# EAGLE design untitled (EAGLE 9.6.2)
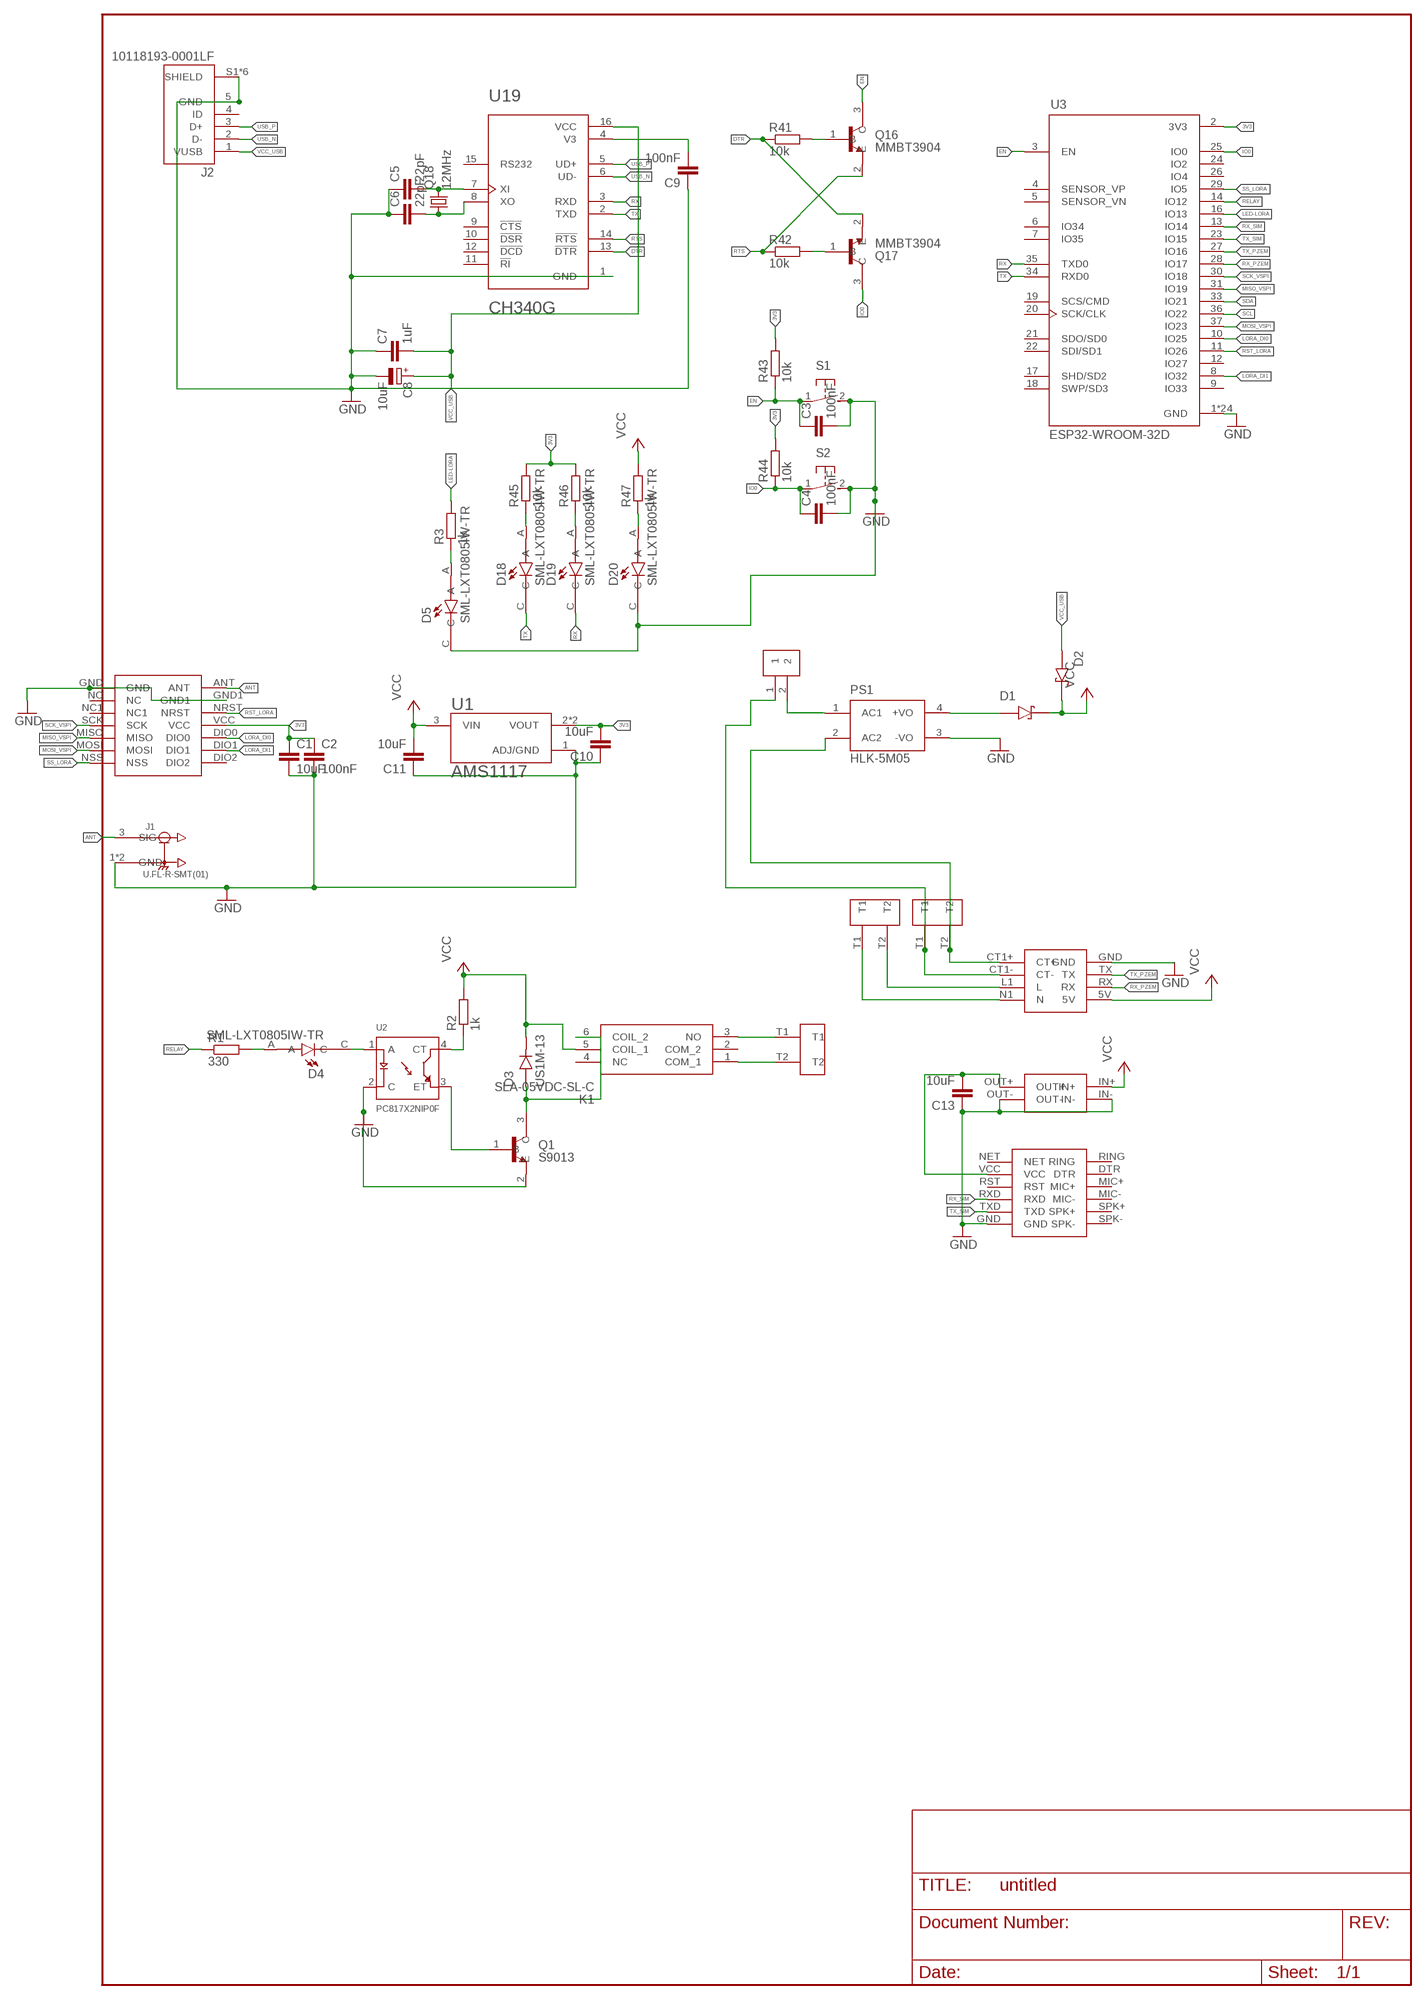
[diagram p0: schematic, sheet 1]

## Parts
C1  10uF  C-EUC0805K  [C0805K]
C2  100nF  C-EUC0805K  [C0805K]
C3  100nF  C-EUC0805K  [C0805K]
C4  100nF  C-EUC0805K  [C0805K]
C5  22pF  C-EUC0805K  [C0805K]
C6  22pF  C-EUC0805K  [C0805K]
C7  1uF  C-EUC0805K  [C0805K]
C8  10uF  CPOL-EU153CLV-0505  [153CLV-0505]
C9  100nF  C-EUC0805K  [C0805K]
C10  10uF  C-EUC0805K  [C0805K]
C11  10uF  C-EUC0805K  [C0805K]
C13  10uF  C-EUC0805K  [C0805K]
D1  1N5819HW-7  [SOD3715X145N]
D2  1N5819HW-7  [SOD3715X145N]
D3  US1M-13  [DIOM5226X240N]
D4  SML-LXT0805IW-TR  [LEDC2012X120N]
D5  SML-LXT0805IW-TR  [LEDC2012X120N]
D18  SML-LXT0805IW-TR  [LEDC2012X120N]
D19  SML-LXT0805IW-TR  [LEDC2012X120N]
D20  SML-LXT0805IW-TR  [LEDC2012X120N]
FUSE-KOTAK1  FUSE-KOTAK  [FUSE-KOTAK]
J1  U.FL-R-SMT(01)  [HRS_U.FL-R-SMT(01)]
J2  10118193-0001LF  [FCI_10118193-0001LF]
K1  SLA-05VDC-SL-C  [SLA05VDCSLC]
LORA-NICERF-V1  LORA-NICERF-V2  [LORA-NICERF-V2]
MINI1  MINI360  [MINI360]
PS1  HLK-5M05  [CONV_HLK-5M05]
PZEM004T1  PZEM004T  [PZEM004T]
Q1  S9013  [SOT95P240X120-3N]
Q16  MMBT3904  [SOT95P240X120-3N]
Q17  MMBT3904  [SOT95P240X120-3N]
Q18  12MHz  CRYSTALSM49  [SM49]
R1  330  R-EU_R0805  [R0805]
R2  1k  R-EU_R0805  [R0805]
R3  1k  R-EU_R0805  [R0805]
R41  10k  R-EU_R0805  [R0805]
R42  10k  R-EU_R0805  [R0805]
R43  10k  R-EU_R0805  [R0805]
R44  10k  R-EU_R0805  [R0805]
R45  10k  R-EU_R0805  [R0805]
R46  10k  R-EU_R0805  [R0805]
R47  1k  R-EU_R0805  [R0805]
S1  31-XX  [B3F-31XX]
S2  31-XX  [B3F-31XX]
SIM800L1  SIM800L  [SIM800L]
TB7.2  TB7.62  [TB7.62]
TB7.3  TB7.62  [TB7.62]
TB7.4  TB7.62  [TB7.62]
U1  AMS1117  [SOT229P700X180-4N]
U2  PC817X2NIP0F  [SOT254P975X400-4N]
U3  ESP32-WROOM-32D  [MODULE_ESP32-WROOM-32D]
U19  CH340G  [SOIC127P600X180-16N]

## Nets
3V3: C1.1 C2.1 C10.2 LORA-NICERF-V1.VCC R43.2 R44.2 R45.2 R46.2 U1.2(VOUT) U1.4(VOUT) U3.2(3V3)
ANT: J1.3(SIG) LORA-NICERF-V1.ANT
DTR: Q17.2(E) R41.1 U19.13(!DTR)
EN: C3.1 Q16.3(C) R43.1 S1.1(P) U3.3(EN)
GND: C1.2 C2.2 C3.2 C4.2 C5.1 C6.1 C7.1 C8.- C9.1 C10.1 C11.1 C13.1 D5.C D20.C J1.1(GND) J1.2(GND) J2.5(GND) J2.S1(SHIELD) J2.S2(SHIELD) J2.S3(SHIELD) J2.S4(SHIELD) J2.S5(SHIELD) J2.S6(SHIELD) LORA-NICERF-V1.GND LORA-NICERF-V1.GND1 MINI1.IN- MINI1.OUT- PS1.3(-VO) PZEM004T1.GND Q1.2(E) S1.2(S) S2.2(S) SIM800L1.GND U1.1(ADJ/GND) U2.2(C) U3.1(GND) U3.15(GND) U3.38(GND) U3.39_1(GND) U3.39_2(GND) U3.39_3(GND) U3.39_4(GND) U3.39_5(GND) U3.39_6(GND) U3.39_7(GND) U3.39_8(GND) U3.39_9(GND) U3.39_10(GND) U3.39_11(GND) U3.39_12(GND) U3.39_13(GND) U3.39_14(GND) U3.39_15(GND) U3.39_16(GND) U3.39_17(GND) U3.39_18(GND) U3.39_19(GND) U3.39_20(GND) U3.39_21(GND) U19.1(GND)
IO0: C4.1 Q17.3(C) R44.1 S2.1(P) U3.25(IO0)
LED-LORA: R3.2 U3.16(IO13)
LORA_DI0: LORA-NICERF-V1.DIO0 U3.10(IO25)
LORA_DI1: LORA-NICERF-V1.DIO1 U3.8(IO32)
MISO_VSPI: LORA-NICERF-V1.MISO U3.31(IO19)
MOSI_VSPI: LORA-NICERF-V1.MOSI U3.37(IO23)
N$1: FUSE-KOTAK1.2 PS1.1(AC1)
N$2: PS1.2(AC2) PZEM004T1.CT1+(CT+) TB7.3.T2
N$3: D1.A PS1.4(+VO)
N$4: D4.C U2.1(A)
N$5: R2.1 U2.4(CT)
N$6: Q1.1(B) U2.3(ET)
N$7: D3.A K1.6(COIL_2) Q1.3(C)
N$8: D4.A R1.2
N$10: K1.1(COM_1) TB7.2.T2
N$11: Q17.1(B) R42.2
N$12: D5.A R3.1
N$13: C13.2 MINI1.OUT+ SIM800L1.VCC
N$14: FUSE-KOTAK1.1 PZEM004T1.CT1-(CT-) TB7.3.T1
N$17: PZEM004T1.L1(L) TB7.4.T2
N$18: PZEM004T1.N1(N) TB7.4.T1
N$19: K1.3(NO) TB7.2.T1
N$99: Q16.1(B) R41.2
N$102: C5.2 Q18.2 U19.7(XI)
N$103: C6.2 Q18.1 U19.8(XO)
N$104: C9.2 U19.4(V3)
N$105: D18.A R45.1
N$106: D19.A R46.1
N$107: D20.A R47.1
RELAY: R1.1 U3.14(IO12)
RST_LORA: LORA-NICERF-V1.NRST U3.11(IO26)
RTS: Q16.2(E) R42.1 U19.14(!RTS)
RX: D19.C U3.35(TXD0) U19.3(RXD)
RX_PZEM: PZEM004T1.RX U3.28(IO17)
RX_SIM: SIM800L1.RXD U3.13(IO14)
SCK_VSPI: LORA-NICERF-V1.SCK U3.30(IO18)
SCL: U3.36(IO22)
SDA: U3.33(IO21)
SS_LORA: LORA-NICERF-V1.NSS U3.29(IO5)
TX: D18.C U3.34(RXD0) U19.2(TXD)
TX_PZEM: PZEM004T1.TX U3.27(IO16)
TX_SIM: SIM800L1.TXD U3.23(IO15)
USB_N: J2.2(D-) U19.6(UD-)
USB_P: J2.3(D+) U19.5(UD+)
VCC: C11.2 D1.C(K) D2.C(K) D3.C(K) K1.5(COIL_1) MINI1.IN+ PZEM004T1.5V R2.2 R47.2 U1.3(VIN)
VCC_USB: C7.2 C8.+ D2.A J2.1(VUSB) U19.16(VCC)
Unconnected: J2.4(ID) K1.2(COM_2) K1.4(NC) LORA-NICERF-V1.DIO2 LORA-NICERF-V1.NC LORA-NICERF-V1.NC1 SIM800L1.DTR SIM800L1.MIC+ SIM800L1.MIC- SIM800L1.NET SIM800L1.RING SIM800L1.RST SIM800L1.SPK+ SIM800L1.SPK- U3.4(SENSOR_VP) U3.5(SENSOR_VN) U3.6(IO34) U3.7(IO35) U3.9(IO33) U3.12(IO27) U3.17(SHD/SD2) U3.18(SWP/SD3) U3.19(SCS/CMD) U3.20(SCK/CLK) U3.21(SDO/SD0) U3.22(SDI/SD1) U3.24(IO2) U3.26(IO4) U19.9(!CTS) U19.10(!DSR) U19.11(!RI) U19.12(!DCD) U19.15(RS232)

## Library data of the parts
C1-C7 C9-C11 C13 = rcl:C-EU: CAPACITOR, European symbol; SPICEPREFIX: C
C8 = rcl:CPOL-EU: POLARIZED CAPACITOR, European symbol; SPICEPREFIX: C
D1 D2 = 1N5819HW-7:1N5819HW-7: 1N5819HW Series 40 V 1 A Surface Mount Schottky Barrier Rectifier - SOD-123 Check availability <https://pricing.snapeda.com/parts/1N5819HW-7/Diodes%20Inc./view-part?ref=eda>; AVAILABILITY: In Stock; DESCRIPTION: Diode Schottky 40 V 1A Surface Mount SOD-123; MF: Diodes Inc.; MP: 1N5819HW-7; PACKAGE: SOD-123 Fairchild Semiconductor; PRICE: None; PURCHASE-URL: https://pricing.snapeda.com/search/part/1N5819HW-7/?ref=eda
D3 = US1M-13:US1M-13: Diode, Fast Recovery, 1a, 1kv, Do-214ac-2, Full Reel Check availability <https://pricing.snapeda.com/parts/US1M-13/Diodes%20Incorporated/view-part?ref=eda>; AVAILABILITY: In Stock; DESCRIPTION: Diode Standard 1000 V 1A Surface Mount SMA; MF: Diodes Incorporated; MP: US1M-13; PACKAGE: DO-214AC-214 Diodes Incorporated; PRICE: None; PURCHASE-URL: https://pricing.snapeda.com/search/part/US1M-13/?ref=eda
D4 D5 D18-D20 = SML-LXT0805IW-TR:SML-LXT0805IW-TR: LED; Luminous Intensity:11µcd; Viewing Angle:140°; Forward Current:30mA; Forward Voltage:2V; Color:Red; LED Color:Red; Leaded Process Compatible:Yes; Lens Color:White; Mounting Type:Surface Mount ;RoHS Compliant: Yes Check availability <https://pricing.snapeda.com/parts/SML-LXT0805IW-TR/Lumex%20Opto/Components/view-part?ref=eda>; AVAILABILITY: In Stock; DESCRIPTION: Red - LED Indication - Discrete 2V 0805 (2012 Metric); MF: Lumex Opto/Components; MP: SML-LXT0805IW-TR; PACKAGE: 0805 Lumex; PRICE: None; PURCHASE-URL: https://pricing.snapeda.com/search/part/SML-LXT0805IW-TR/?ref=eda
FUSE-KOTAK1 = FUSE-KOTAK:FUSE-KOTAK
J1 = U.FL-R-SMT_01_:U.FL-R-SMT(01): U.FL Series 6 Ghz 50 Ohm Ultra-small SMT Coaxial Cable Receptacle Check availability <https://pricing.snapeda.com/parts/U.FL-R-SMT%2801%29/Hirose/view-part?ref=eda>; AVAILABILITY: In Stock; DESCRIPTION: U.FL (UMCC) Connector Receptacle, Male Pin 50Ohm Surface Mount Solder. RF Connectors / Coaxial Connectors; MF: Hirose; MP: U.FL-R-SMT(01); PACKAGE: None; PRICE: None; PURCHASE-URL: https://pricing.snapeda.com/search/part/U.FL-R-SMT(01)/?ref=eda
J2 = 10118193-0001LF:10118193-0001LF: Micro USB B Type Receptacle Check availability <https://pricing.snapeda.com/parts/10118193-0001LF/FCI/view-part?ref=eda>; AVAILABILITY: In Stock; DESCRIPTION: USB - micro B USB 2.0 Receptacle Connector 5 Position Surface Mount, Right Angle; Through Hole; MF: FCI; MP: 10118193-0001LF; PACKAGE: None; PRICE: None; PURCHASE-URL: https://pricing.snapeda.com/search/part/10118193-0001LF/?ref=eda
K1 = SLA-05VDC-SL-C:SLA-05VDC-SL-C: Relays General Purpose Non Latching 5VDC SPDT 30A (250VAC) Max Plugin RoHS Source: Datasheet <https://datasheet.lcsc.com/szlcsc/Ningbo-Songle-Relay-SLA-05VDC-SL-C_C87367.pdf>; DESCRIPTION: Relays General Purpose Non Latching 5VDC SPDT 30A (250VAC) Max Plugin RoHS; HEIGHT: 20.4mm; MANUFACTURER_NAME: Songle Relay; MANUFACTURER_PART_NUMBER: SLA-05VDC-SL-C
LORA-NICERF-V1 = LORA-NICERF-V2:LORA-NICERF-V2
MINI1 = mini360:MINI360
PS1 = HLK-5M05:HLK-5M05: AC DC 220V to 5V 5W 5Watt Isolated Switching Step-Down Power Supply Module Converter Check availability <https://pricing.snapeda.com/parts/HLK-5M05/Hi-link/view-part?ref=eda>; AVAILABILITY: Not in stock; MF: Hi-link; MP: HLK-5M05; PACKAGE: Package; PRICE: None
PZEM004T1 = PZEM004T:PZEM004T
Q1 = S9013:S9013: SMD Transistors NPN 25V-500mA Check availability <https://pricing.snapeda.com/parts/S9013/JCET/view-part?ref=eda>; AVAILABILITY: In Stock; DESCRIPTION: Bipolar (BJT) Transistor NPN 20V 500mA 625mW Through Hole TO-92-3; MF: JCET; MP: S9013; PACKAGE: SOT-23-3 JCET; PRICE: None; PURCHASE-URL: https://pricing.snapeda.com/search/part/S9013/?ref=eda
Q16 Q17 = MMBT3904:MMBT3904: MMBT3904 Series 40 V CE Breakdown 0.2 A NPN General Purpose Amplifier - SOT-23 Check availability <https://pricing.snapeda.com/parts/MMBT3904/ON%20Semiconductor/view-part?ref=eda>; AVAILABILITY: In Stock; DESCRIPTION: Bipolar (BJT) Transistor NPN 40 V 200 mA 300MHz 300 mW Surface Mount SOT-23-3 (TO-236); MF: ON Semiconductor; MP: MMBT3904; PACKAGE: SOT-23-3 Motorola; PRICE: None
Q18 = crystal:CRYSTAL: CRYSTAL; OC_FARNELL: unknown; OC_NEWARK: unknown
R1-R3 R41-R47 = rcl:R-EU_: RESISTOR, European symbol; SPICEPREFIX: R
S1 S2 = switch-omron:31-XX: OMRON SWITCH; MPN: B3F-3100; OC_FARNELL: 959704; OC_NEWARK: 36M3582
SIM800L1 = sim800l:SIM800L
TB7.2-TB7.4 = TB7.62:TB7.62
U1 = AMS1117:AMS1117: Sot223/Pkg 1-Amp 5-Volt Low Drop Out Voltage Regulatator Check availability <https://pricing.snapeda.com/parts/AMS1117/Advanced%20Monolithic%20Systems/view-part?ref=eda>; AVAILABILITY: Not in stock; DESCRIPTION: 1A LOW DROPOUT VOLTAGE REGULATOR SOT-223; MF: Advanced Monolithic Systems; MP: AMS1117; PACKAGE: SOT-223 Seeed Technology; PRICE: None
U2 = PC817X2NIP0F:PC817X2NIP0F: PC817 Series 1 Channel 80 V 5000 Vrms General Purpose Photocoupler - DIP-4 Check availability <https://pricing.snapeda.com/parts/PC817X2NIP0F/Sharp%20Microelectronics/view-part?ref=eda>; AVAILABILITY: Not in stock; DESCRIPTION: Optoisolator Transistor Output 5000Vrms 1 Channel 4-SMD; MF: Sharp Microelectronics; MP: PC817X2NIP0F; PACKAGE: SMD-4 Sharp Microelectronics; PRICE: None
U3 = ESP32-WROOM-32D:ESP32-WROOM-32D: Bluetooth, WiFi 802.11b/g/n, Bluetooth v4.2 + EDR, Class 1, 2 and 3 Transceiver Module 2.4GHz ~ 2.5GHz Integrated, Trace Surface Mount Check availability <https://pricing.snapeda.com/parts/ESP32-WROOM-32D/Espressif%20Systems/view-part?ref=eda>; AVAILABILITY: In Stock; DESCRIPTION: Bluetooth, WiFi 802.11b/g/n, Bluetooth v4.2 +EDR, Class 1, 2 and 3 Transceiver Module 2.4GHz ~ 2.5GHz Integrated; MF: Espressif Systems; MP: ESP32-WROOM-32D; PACKAGE: Module Espressif Systems; PRICE: None; PURCHASE-URL: https://pricing.snapeda.com/search/part/ESP32-WROOM-32D/?ref=eda
U19 = CH340G:CH340G: Check availability <https://pricing.snapeda.com/parts/Ch340G/WCH/view-part?ref=eda>; AVAILABILITY: Not in stock; DESCRIPTION: USB Interface Integrated Circuit; MF: WCH; MP: Ch340G; PACKAGE: None; PRICE: None

## Board
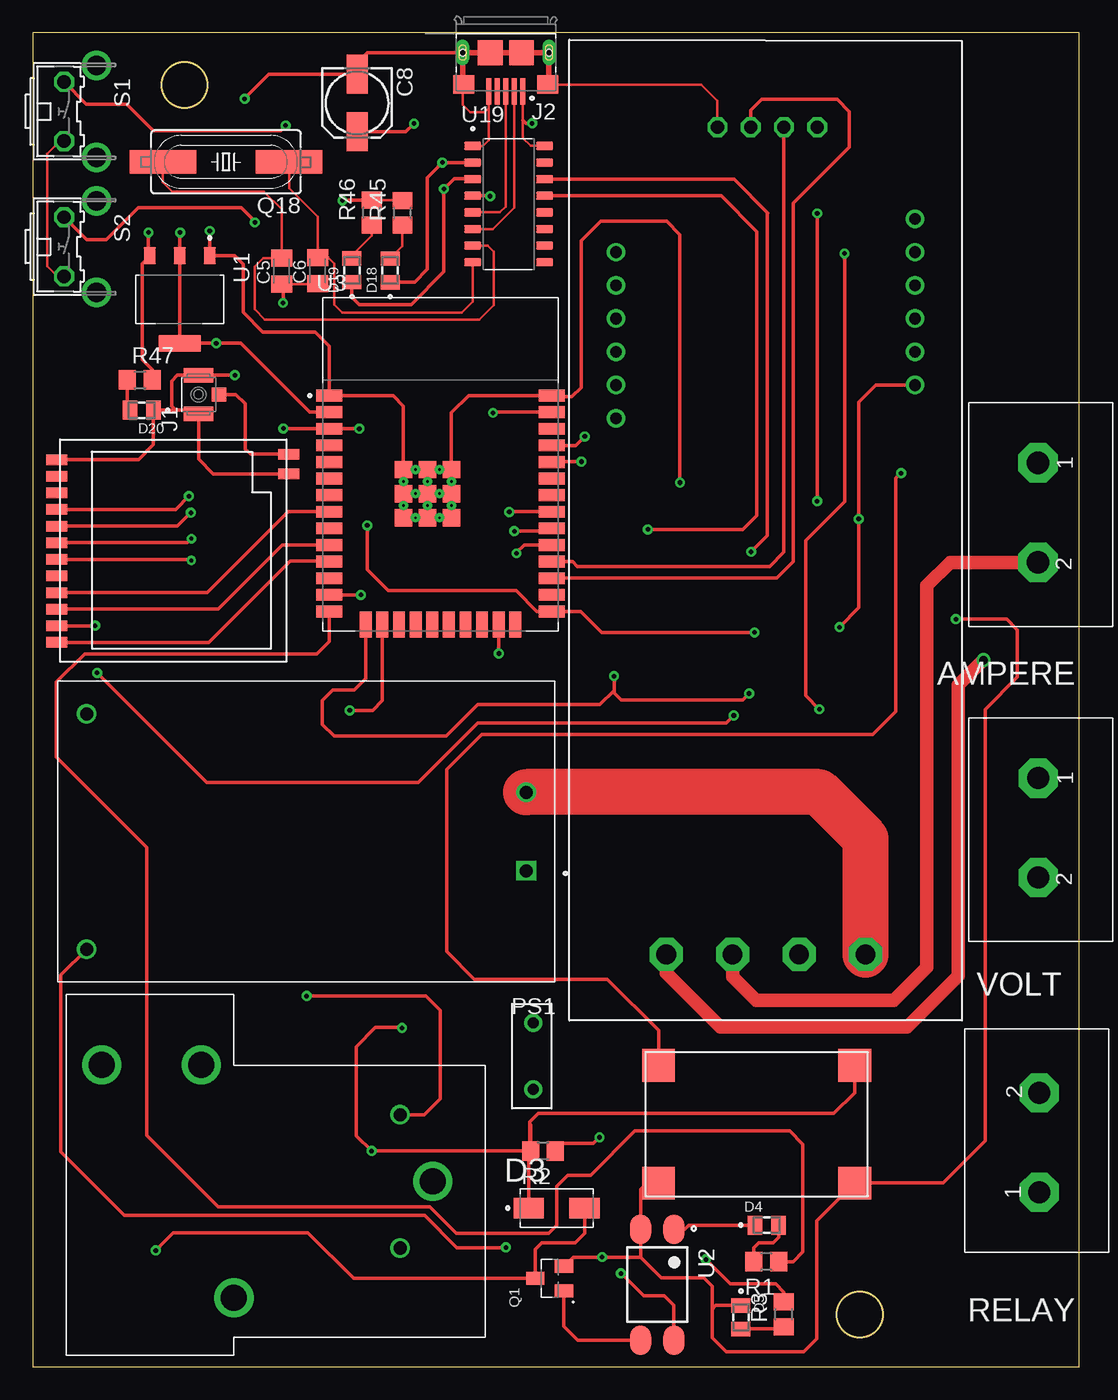
[diagram p1: board, top side]
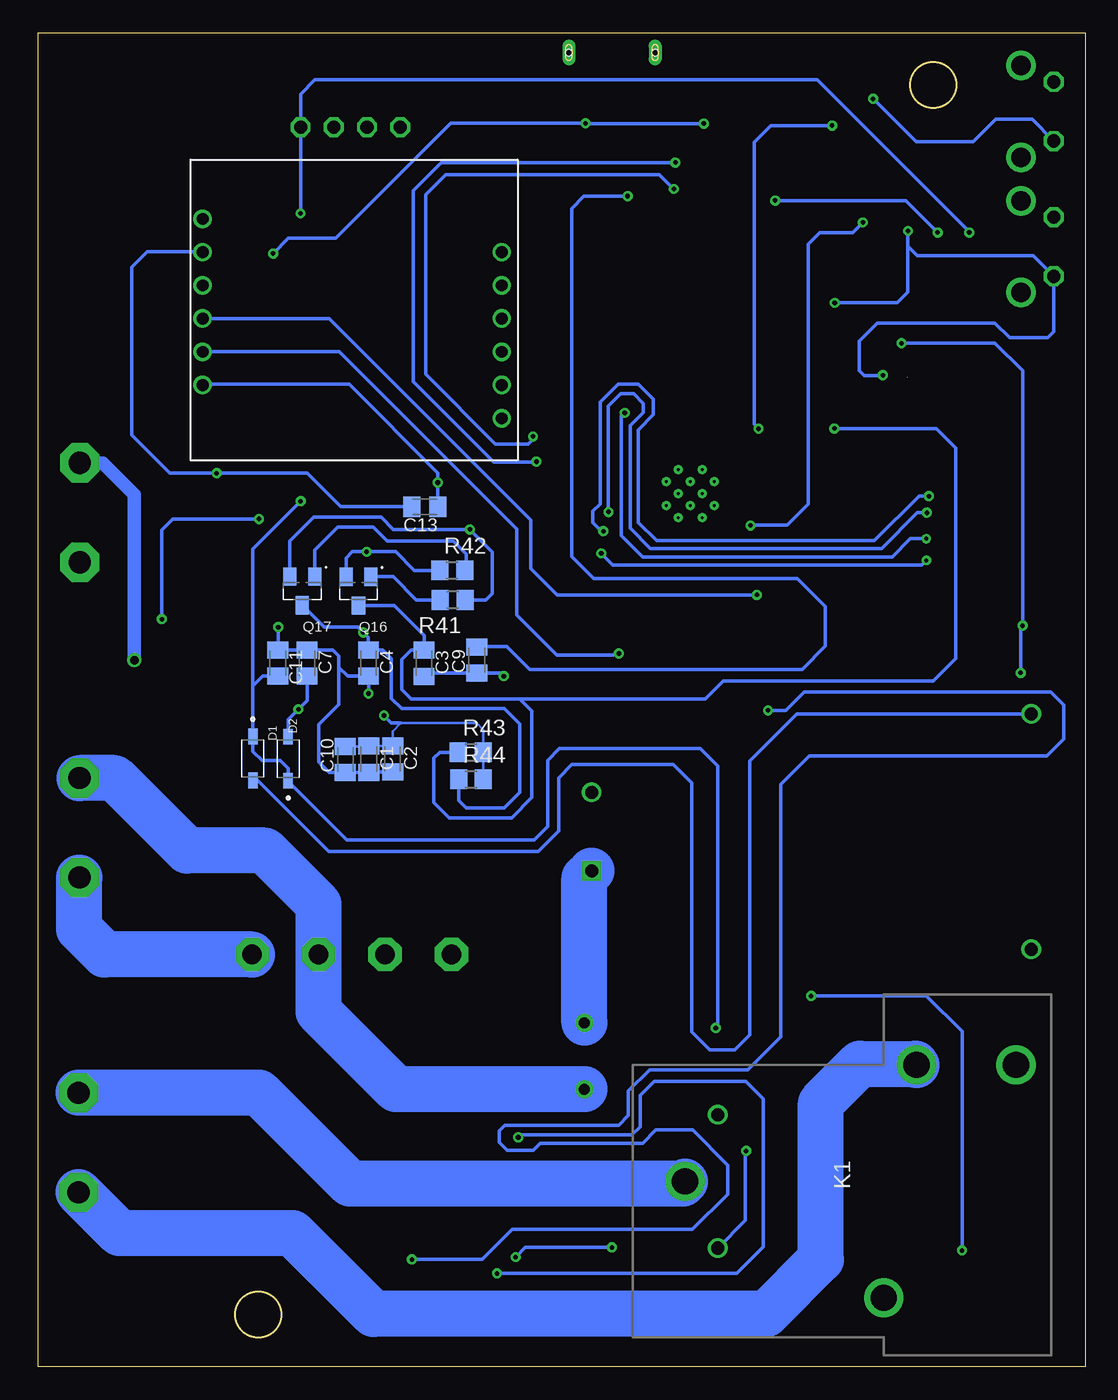
[diagram p2: board, bottom side, seen from below]

Size 80 x 102 mm. Coordinates in mm from the lower left corner, seen from the top.
Outline: 0,102 0,0 80,0 80,102 0,102
Outline: circle at 11.6,98 radius 1.75
Outline: circle at 63.2,4 radius 1.75
Copper layers (1*16): Top 0.035mm / dielectric 1.5mm / Bottom 0.035mm
Design rules "default *": minimum track width 6mil, minimum drill 0.35mm, track to track 6mil, track to pad 6mil, pad to pad 6mil, via to via 6mil, smd to smd 6mil, copper to edge 40mil, drill to drill 6mil, minimum pad ring 10mil, minimum via ring 8mil, stop-mask expansion 4mil, vias tented up to drill 0mil, thermal gap 10mil

### Footprints (pad centres in the part's own frame; a part is rotated, then mirrored left to right if it is on the bottom)
C0805K = smd 1.3 x 1.6: 1 -1,0; 2 1,0
153CLV-0505 = smd 3 x 1.6: + 2.2,0; - -2.2,0
SOD3715X145N = smd 1.21 x 0.73: A 1.68,0; C -1.68,0
DIOM5226X240N = smd 2.33 x 1.55: A 2.135,0; C -2.135,0
LEDC2012X120N = smd 1.1 x 1.45: A 0.9,0; C -0.9,0
FUSE-KOTAK = drill 0.85: 1 -5.54,-0.62; 2 -0.46,-0.62
HRS_U.FL-R-SMT(01) = smd 1.1 x 2.25: 1 -1.475,0; 2 1.475,0 | smd 1.05 x 1.1: 3 0,-1.55
FCI_10118193-0001LF = smd 0.4 x 2: 1 -1.3,2.975; 2 -0.65,2.975; 3 0,2.975; 4 0.65,2.975; 5 1.3,2.975 | smd 1.6 x 1.4: S1 -3.2,2.45; S2 3.2,2.45 | smd 1.9 x 1.9: S3 1.2,0; S4 -1.2,0 | drill 0.5 pad 0.9 long: S5 -3.3,0; S6 3.3,0 | hole 0.5: -3.3,0; 3.3,0
SLA05VDCSLC = drill 2 pad 3: 1 0,0; 2 8.9,15.2; 3 -8.9,17.7; 4 -8.9,25.3 | drill 1 pad 1.5: 5 5.1,2.5; 6 -5.1,2.5
LORA-NICERF-V2 = smd 1.6 x 0.8: ANT 9.17,6.81; DIO0 -8.57,-5.03; DIO1 -8.57,-3.76; DIO2 -8.57,-2.49; GND -8.57,6.4; GND1 9.17,5.31; MISO -8.57,1.32; MOSI -8.57,0.05; NC -8.57,5.13; NC1 -8.57,3.86; NRST -8.57,-7.57; NSS -8.57,-1.22; SCK -8.57,2.59; VCC -8.57,-6.3
MINI360 = smd 2.5 x 2.5: IN+ 1,1; IN- 1,10; OUT+ 16,1; OUT- 16,10
CONV_HLK-5M05 = drill 1 pad 1.5 square: 1 -16.8,3 | drill 1 pad 1.5: 2 -16.8,-3; 3 16.8,9; 4 16.8,-9
PZEM004T = drill 1 octagon: 5V 3.7,-10.06; GND 3.7,-17.68; RX 3.7,-12.6; TX 3.7,-15.14 | drill 1.5 pad 2.54 octagon: CT1+ 66.94,-6.36; CT1- 66.94,-11.44; L1 66.94,-16.52; N1 66.94,-21.6
SOT95P240X120-3N = smd 1 x 1.4: 1 -0.95,-1.1; 2 0.95,-1.1; 3 0,1.1
SM49 = smd 5.08 x 1.778: 1 -4.826,0; 2 4.826,0
R0805 = smd 1.3 x 1.5: 1 -0.95,0; 2 0.95,0
B3F-31XX = drill 1.016 octagon: 1 -2.261,-1.245; 2 2.261,-1.245 | drill 1.499 pad 2.159: 3 -3.505,1.245; 4 3.505,1.245
SIM800L = drill 0.9: DTR 17.78,-7.62; GND -5.08,-15.24; MIC+ 17.78,-10.16; MIC- 17.78,-12.7; NET -5.08,-2.54; RING 17.78,-5.08; RST -5.08,-7.62; RXD -5.08,-10.16; SPK+ 17.78,-15.24; SPK- 17.78,-17.78; TXD -5.08,-12.7; VCC -5.08,-5.08
TB7.62 = drill 1.7 pad 3 octagon: T1 -3.8,0; T2 3.8,0
SOT229P700X180-4N = smd 1.31 x 0.93: 1 -3.345,2.29; 2 -3.345,0; 3 -3.345,-2.29 | smd 1.31 x 3.24: 4 3.345,0
SOT254P975X400-4N = smd 2.25 x 1.6: 1 -4.25,1.27; 2 -4.25,-1.27; 3 4.25,-1.27; 4 4.25,1.27
MODULE_ESP32-WROOM-32D = smd 2 x 0.9: 1 -8.5,5.26; 2 -8.5,3.99; 3 -8.5,2.72; 4 -8.5,1.45; 5 -8.5,0.18; 6 -8.5,-1.09; 7 -8.5,-2.36; 8 -8.5,-3.63; 9 -8.5,-4.9; 10 -8.5,-6.17; 11 -8.5,-7.44; 12 -8.5,-8.71; 13 -8.5,-9.98; 14 -8.5,-11.25; 25 8.5,-11.25; 26 8.5,-9.98; 27 8.5,-8.71; 28 8.5,-7.44; 29 8.5,-6.17; 30 8.5,-4.9; 31 8.5,-3.63; 32 8.5,-2.36; 33 8.5,-1.09; 34 8.5,0.18; 35 8.5,1.45; 36 8.5,2.72; 37 8.5,3.99; 38 8.5,5.26 | smd 0.9 x 2: 15 -5.715,-12.25; 16 -4.445,-12.25; 17 -3.175,-12.25; 18 -1.905,-12.25; 19 -0.635,-12.25; 20 0.635,-12.25; 21 1.905,-12.25; 22 3.175,-12.25; 23 4.445,-12.25; 24 5.715,-12.25 | smd 1.33 x 1.33: 39_1 -2.835,-0.405; 39_2 -1,-0.405; 39_3 0.835,-0.405; 39_4 -2.835,-2.24; 39_5 -1,-2.24; 39_6 0.835,-2.24; 39_7 -2.835,-4.075; 39_8 -1,-4.075; 39_9 0.835,-4.075 | drill 0.2 pad 0.3: 39_10 -1.917,-0.405; 39_11 -0.083,-0.405; 39_12 -2.835,-1.323; 39_13 -1,-1.323; 39_14 0.835,-1.323; 39_15 -1.917,-2.24; 39_16 -0.083,-2.24; 39_17 -2.835,-3.158; 39_18 -1,-3.158; 39_19 0.835,-3.158; 39_20 -1.917,-4.075; 39_21 -0.083,-4.075
SOIC127P600X180-16N = smd 1.31 x 0.62: 1 -2.75,4.445; 2 -2.75,3.175; 3 -2.75,1.905; 4 -2.75,0.635; 5 -2.75,-0.635; 6 -2.75,-1.905; 7 -2.75,-3.175; 8 -2.75,-4.445; 9 2.75,-4.445; 10 2.75,-3.175; 11 2.75,-1.905; 12 2.75,-0.635; 13 2.75,0.635; 14 2.75,1.905; 15 2.75,3.175; 16 2.75,4.445

### Placement (x,y rotation side)
C1  54.75,46.45 270 bottom
C2  52.93,46.46 270 bottom
C3  50.52,53.79 270 bottom
C4  54.77,53.81 270 bottom
C5  19.02,83.77 90 top
C6  21.78,83.81 90 top
C7  59.47,53.8 270 bottom
C8  24.8,96.62 270 top
C9  46.49,54.04 90 bottom
C10  56.53,46.44 90 bottom
C11  61.7,53.8 270 bottom
C13  50.47,65.75 180 bottom
D1  63.6,46.52 270 bottom
D2  60.9,46.49 90 bottom
D3  40.05,12.14 0 top
D4  56.11,10.83 0 top
D5  54.13,3.79 270 top
D18  27.32,83.82 90 top
D19  24.4,83.83 90 top
D20  8.33,73.13 180 top
FUSE-KOTAK1  37.64,26.76 90 top
J1  12.68,74.34 90 top
J2  36.16,100.48 180 top
K1  30.57,14.18 270 bottom
LORA-NICERF-V1  10.41,62.96 0 top
MINI1  63.83,24.05 180 top
PS1  20.92,40.92 180 top
PZEM004T1  70.02,98.47 270 top
Q1  39.51,6.75 90 top
Q16  55.53,59.31 180 bottom
Q17  59.82,59.32 180 bottom
Q18  14.77,92.12 180 top
R1  56.07,8.04 180 top
R2  39,16.51 180 top
R3  57.4,4.01 90 top
R41  48.32,58.62 180 bottom
R42  48.38,60.9 0 bottom
R43  46.94,46.99 0 bottom
R44  46.93,44.91 0 bottom
R45  28.26,88.22 90 top
R46  25.92,88.23 90 top
R47  8.19,75.44 0 top
S1  3.64,95.98 270 top
S2  3.64,85.64 270 top
SIM800L1  62.36,90.3 0 bottom
TB7.2  76.93,17.15 90 top
TB7.3  76.86,41.21 270 top
TB7.4  76.83,65.31 270 top
U1  11.24,81.6 270 top
U2  47.73,6.28 270 top
U3  31.17,69 0 top
U19  36.37,88.9 0 top

### Tracks (layer width: path | path; a pad name or v marks a point on that pad's centre or on a via)
3V3  (via drill 0.35)
  Top 0.203: R46.2 28.25,89.18 R45.2
  Top 0.254: U3.2 21.18,72.99 15.91,78.26 v14.03,78.26 U1.4 U1.2 11.24,86.69 v11.27,86.72 | v23.68,89.17 v23.69,89.18 R46.2 | LORA-NICERF-V1.VCC 4.76,56.66 v4.77,56.67 v4.78,56.66 | v53.58,49.8 53.02,49.24 34.03,49.24 29.48,44.69 13.28,44.69 v4.92,53.05
  Bottom 0.203: R44.2 45.98,46.98 R43.2 45.99,48.69 46.51,49.21 52.29,49.21 52.93,48.57 C2.1 C1.1 C10.2
  Bottom 0.254: v11.27,86.72 13.72,89.17 v23.68,89.17 | v14.03,78.26 14.03,78.28 6.89,78.28 4.78,76.17 v4.78,56.66 4.92,56.51 v4.92,53.05 | 52.29,49.21 53.03,49.21 53.6,49.78 v53.58,49.8
ANT
  Top 0.254: J1.3 15.54,74.34 16.25,73.63 16.25,70.16 16.65,69.77 LORA-NICERF-V1.ANT
DTR  (via drill 0.35)
  Top 0.254: U19.13 52.61,89.53 55.33,86.81 55.33,65.08 54.27,64.02 47.08,64.02 47.08,64.03 v47.03,64.03 v47.02,64.02
  Bottom 0.254: R41.1 45.79,58.62 45.3,59.11 45.3,62.3 v47.02,64.02 52.87,64.02 53.81,64.95 58.94,64.95 60.77,63.12 Q17.2
EN  (via drill 0.35)
  Top 0.254: S1.1 4.1,96.53 7.2,96.53 9.21,94.52 18.96,94.52 19.33,94.88 v19.33,94.9 | v24.96,71.72 v24.95,71.72 U3.3 22.65,71.74 v19.15,71.74
  Bottom 0.254: Q16.3 52.81,58.21 50.52,55.92 C3.1 51.51,54.79 52.24,54.06 52.24,51.79 51.49,51.04 43.2,51.04 | R43.1 49.34,46.98 49.78,46.54 49.78,43.16 48.6,41.98 43.83,41.98 42.3,43.52 42.3,50.13 43.2,51.04 | v19.33,94.9 24.01,94.9 25.29,93.62 25.29,72.06 v24.96,71.72 | 43.2,51.04 29.02,51.04 27.63,52.43 11.6,52.43 9.89,54.14 9.89,70.26 11.37,71.74 v19.15,71.74
GND  (via drill 0.35)
  Top 0.203: J2.5 34.86,96.24 | 34.86,96.24 34.53,95.91 33.45,95.91 32.86,96.5 32.86,98.13 | J2.S1 51.09,98.03 52.34,96.79 PZEM004T1.GND | 34.86,96.24 34.86,93.78 34.41,93.33 33.63,93.33 U19.1 | S2.2 1.87,83.38 1.12,84.13 1.12,92.75 2.08,93.71 S1.2 | 19.06,82.81 C5.1 21.73,82.77 C6.1
  Top 0.254: J2.S6 25.57,100.48 24.8,99.71 C8.- 18.05,98.83 16.18,96.96 v16.2,96.94 | 10.94,73.13 12.41,73.13 J1.1 12.68,69.38 13.8,68.27 LORA-NICERF-V1.GND1 | 10.94,73.13 D20.C 9.23,70.5 8.09,69.35 LORA-NICERF-V1.GND | J1.2 11.05,75.81 10.61,75.37 10.61,73.47 10.94,73.13 | 46.46,8.39 48.04,6.8 48.05,6.81 51.27,6.81 51.92,6.16 51.92,4.41 | 46.46,8.39 U2.2 46.46,13.58 46.93,14.05 MINI1.OUT- | 46.46,8.39 v43.52,8.39 41.3,8.39 Q1.2 | D5.C 52.2,4.69 51.92,4.41 | 51.92,4.41 51.92,2.23 53.01,1.14 58.93,1.14 59.93,2.15 59.93,11.15 MINI1.IN- 69.59,14.05 72.8,17.26 72.8,50.27 75.26,52.73 75.26,56.35 74.44,57.16 v70.55,57.16 | v13.53,86.84 U1.1 15.45,84.95 16.08,84.32 16.08,80.63 17.59,79.12 21.6,79.12 22.67,78.05 U3.1 27.54,74.26 28.34,73.46 U3.39_1 | C5.1 19.14,82.65 19.14,81.36 v19.13,81.34 | SIM800L1.GND 64.43,75.06 63.13,73.77 v63.13,64.82 63.13,58.05 61.66,56.58 v61.66,56.55 | U3.39_3 32.01,72.96 33.31,74.26 U3.38 39.77,74.16 41.21,74.16 41.91,74.85 41.91,86.09 43.4,87.58 48.46,87.58 49.47,86.57 v49.47,67.6 | PS1.3 2.14,29.95 2.14,16.43 7,11.56 29.95,11.56 32.41,9.11 36.16,9.11 v36.17,9.12 | U3.15 25.45,52.64 24.57,51.75 22.95,51.75 22.14,50.94 22.14,49.1 23.03,48.21 31.6,48.21 34,50.62 43.34,50.62 44.43,51.7 v44.43,52.8 44.43,51.52 44.97,50.98 54.26,50.98 v54.76,51.48 | v15.45,75.81 J1.2 | J1.2 | v16.2,96.94
  Top 0.406: J2.S1 39.46,98.13 J2.S5 J2.S4 J2.S3 J2.S6 32.86,98.13 J2.S2 | U3.39_2 U3.39_10 U3.39_1 U3.39_12 U3.39_4 | U3.39_2 U3.39_11 U3.39_3 U3.39_14 32.01,66.85 | 32.01,66.85 U3.39_6 U3.39_19 U3.39_9 U3.39_21 U3.39_8 | U3.39_2 U3.39_13 U3.39_5 | U3.39_4 U3.39_15 30.14,66.76 | 30.14,66.76 U3.39_5 | U3.39_5 U3.39_16 31.17,66.85 32.01,66.85 | 30.14,66.76 30.17,66.73 U3.39_18 U3.39_8 | U3.39_8 U3.39_20 U3.39_7 U3.39_17 U3.39_4
  Bottom 0.254: C2.2 54.74,45.46 C1.2 56.52,45.45 C10.1 57.74,45.44 58.56,46.26 58.56,49.09 57.02,50.63 57.02,53.47 | C3.2 50.27,53.04 C9.1 44.67,53.04 v44.43,52.8 | C4.2 54.75,52.79 | C4.2 56.36,52.81 57.02,53.47 | 57.02,53.47 57.02,54.34 57.5,54.82 59.44,54.82 C7.1 61.66,54.8 | C11.1 61.66,54.8 | 13.55,85.66 12.84,84.95 3.97,84.95 S2.2 2.39,79.14 2.87,78.67 5.76,78.67 6.89,79.81 15.89,79.81 17.27,78.43 17.27,76.18 16.89,75.79 15.48,75.79 v15.45,75.82 v15.45,75.81 | 13.55,85.66 13.55,86.84 v13.53,86.84 | v19.13,81.34 14.36,81.34 13.55,82.15 13.55,85.66 | C13.1 v49.47,67.6 49.47,68.35 56.24,75.12 67.39,75.12 SIM800L1.GND | v61.66,56.55 61.66,54.8 | v36.17,9.12 42.78,9.12 v43.52,8.39 | v43.52,8.39 | v70.55,57.16 70.55,63.99 69.72,64.82 v63.13,64.82 63.08,64.82 | v16.2,96.94 12.91,93.65 8.53,93.65 6.81,95.37 4.05,95.37 S1.2 | 54.76,51.42 v54.76,51.48 C4.2
IO0  (via drill 0.35)
  Top 0.254: S2.1 4.13,86.17 5.63,86.17 8.09,88.62 15.95,88.62 17.03,87.54 v16.98,87.49 | v25.57,64.33 25.57,60.95 27.18,59.34 36.94,59.34 38.53,57.75 U3.25 39.68,57.76 41.89,57.76 43.5,56.15 v55.16,56.15
  Bottom 0.254: Q17.3 58.15,56.56 55.57,56.56 v55.16,56.15 54.77,55.75 C4.1 53.66,54.81 53.01,54.16 53.01,51.1 52.24,50.33 44.38,50.33 43.2,49.15 43.2,43.89 44.38,42.71 47.3,42.71 47.88,43.28 R44.1 | v16.98,87.49 17.75,86.73 20.27,86.73 21.17,85.83 21.17,65.96 22.77,64.36 25.54,64.36 v25.57,64.33
LED-LORA  (via drill 0.35)
  Top 0.254: R3.2 57.4,5.71 56.78,6.33 53.33,6.33 v51.45,8.2 | v24.23,50.19 25.97,50.19 26.73,50.94 26.73,56.74 U3.16
  Bottom 0.254: v51.45,8.2 46.07,8.2 43.78,10.49 30.01,10.49 27.3,13.21 27.3,15.4 30,18.1 32.8,18.1 33.82,17.09 41.62,17.09 42.16,16.55 44.16,16.55 44.76,17.15 44.76,18.05 44.34,18.48 35.64,18.48 34.89,19.22 34.89,21.08 33.27,22.7 25.77,22.7 23.25,25.22 23.25,44.54 21.07,46.72 2.91,46.72 1.61,48.01 1.61,50.59 2.63,51.6 21.45,51.6 22.86,50.19 v24.23,50.19
LORA_DI0
  Top 0.254: LORA-NICERF-V1.DIO0 14.16,57.92 19.07,62.83 U3.10
LORA_DI1
  Top 0.254: LORA-NICERF-V1.DIO1 13.35,59.2 19.53,65.38 U3.8
MISO_VSPI  (via drill 0.35)
  Top 0.254: LORA-NICERF-V1.MISO 11.06,64.28 v12.09,65.3 | v36.42,65.36 v36.43,65.37 U3.31
  Bottom 0.254: v12.09,65.3 12.8,65.3 15.55,62.56 33.21,62.56 34.77,64.12 34.77,71.95 33.76,72.96 33.76,73.65 34.51,74.4 35.5,74.4 36.43,73.47 36.43,65.38 36.44,65.37 v36.42,65.36
MOSI_VSPI  (via drill 0.3, 0.35)
  Top 0.254: LORA-NICERF-V1.MOSI 11.82,63.01 v12.13,63.31 | v35.18,72.94 35.22,72.97 39.66,72.97 U3.37
  Bottom 0.254: v12.13,63.31 13.34,63.31 14.73,61.92 33.82,61.92 35.44,63.55 35.44,72.67 v35.18,72.94
N$1
  Bottom 3.5: FUSE-KOTAK1.2 38.26,37.38 PS1.1
N$2
  Top 3.5: PZEM004T1.CT1+ 63.66,40.38 60.1,43.94 37.73,43.94 PS1.2
  Bottom 3.5: PZEM004T1.CT1+ 74.94,31.53 76.87,33.46 76.87,37.39 TB7.3.T2
N$3
  Bottom 0.254: PS1.4 22.03,49.92 25.62,46.33 25.62,25.37 26.78,24.22 28.69,24.22 30.07,25.61 30.07,44.65 31.46,46.03 39.21,46.03 40.22,45.02 40.22,40.97 41.78,39.42 57.8,39.42 63.21,44.84 D1.A
N$4
  Top 0.254: U2.1 49.82,10.53 50.13,10.83 D4.C
N$5  (via drill 0.35)
  Top 0.254: U2.4 49,4.7 48.28,5.42 46.69,5.42 44.97,7.14 v44.95,7.14 | v43.32,17.54 42.85,17.07 40.51,17.07 R2.1
  Bottom 0.254: v44.95,7.14 26.63,7.14 24.59,9.18 24.59,20.48 25.94,21.83 32.92,21.83 34.01,20.75 34.01,18.36 34.65,17.73 43.13,17.73 v43.32,17.54
N$6
  Top 0.254: U2.3 41.66,2.03 40.58,3.1 40.58,5.77 Q1.1
N$7  (via drill 0.35)
  Top 0.254: D3.A 42.19,12.13 42.19,10.22 41.47,9.49 38.92,9.49 38.41,8.98 Q1.3 24.53,6.75 21.03,10.25 10.76,10.25 v9.4,8.9 | v20.94,28.35 30.03,28.35 31.14,27.24 31.14,20.5 29.91,19.26 28.09,19.26 K1.6
  Bottom 0.254: v9.4,8.9 9.4,25.63 12.12,28.35 v20.94,28.35
N$8
  Top 0.254: R1.2 55.12,9.11 55.49,9.48 56.58,9.48 57.01,9.9 D4.A
N$10
  Bottom 3.5: TB7.2.T2 63.12,20.95 56.19,14.02 30.73,14.02 K1.1
N$11
  Bottom 0.254: Q17.1 58.87,62.44 57.11,64.2 54.4,64.2 53.32,63.13 48.3,63.13 47.3,62.13 47.3,61.02 R42.2
N$12
  Top 0.254: R3.1 57.24,2.89 D5.A
N$13  (via drill 0.35)
  Top 0.254: MINI1.OUT+ 47.83,25.7 43.92,29.62 33.76,29.62 31.63,31.75 31.63,45.66 34.33,48.35 64.22,48.35 65.96,50.09 65.96,67.94 66.37,68.35 v66.37,68.32
  Bottom 0.254: C13.2 56.89,65.75 59.46,68.32 v66.37,68.32 69.94,68.32 72.86,71.24 72.86,84.08 71.69,85.25 67.47,85.25 SIM800L1.VCC
N$14
  Bottom 3.5: FUSE-KOTAK1.1 52.65,21.21 58.58,27.14 PZEM004T1.CT1- 58.58,35.36 62.69,39.47 68.62,39.47 74.17,45.01 TB7.3.T1
N$17
  Top 1.016: PZEM004T1.L1 53.5,29.8 55.29,28.01 65.82,28.01 68.35,30.53 68.35,59.73 70.12,61.51 TB7.4.T2
N$18  (via drill 0.65)
  Top 1.016: PZEM004T1.N1 48.42,30.13 52.56,25.99 66.84,25.99 70.74,29.88 70.74,52.14 72.64,54.05 | 72.64,54.05 | 72.64,54.05 v72.66,54.03
  Bottom 1.016: v72.66,54.03 72.66,66.68 75.09,69.11 TB7.4.T1
N$19
  Bottom 3.5: TB7.2.T1 73.79,10.21 60.56,10.21 54.4,4.05 24.34,4.05 20.19,8.2 20.19,20.18 17.2,23.16 12.96,23.16 K1.3
N$99
  Bottom 0.254: R41.2 51.1,58.62 52.88,60.41 Q16.1
N$102
  Top 0.203: Q18.2 9.95,90.56 10.65,89.85 17.67,89.85 19.02,88.5 C5.2 17.61,84.77 16.96,84.12 16.96,80.85 17.75,80.06 34.14,80.06 35.24,81.16 35.24,85.25 34.77,85.72 U19.7
N$103
  Top 0.203: Q18.1 19.6,90.13 21.77,87.95 C6.2 22.6,84.81 23.05,84.36 23.05,81.22 23.66,80.61 32.78,80.61 33.62,81.46 U19.8
N$104  (via drill 0.35)
  Top 0.254: U19.4 34.97,89.53 34.98,89.52 v34.96,89.5
  Bottom 0.254: v34.96,89.5 38.3,89.5 39.25,88.55 39.25,61.96 37.56,60.27 21.99,60.27 19.85,58.13 19.85,55.1 21.63,53.33 42.44,53.33 44.19,55.08 46.45,55.08 C9.2
N$105
  Top 0.203: D18.A 28.26,85.67 R45.1
N$106
  Top 0.203: D19.A 24.39,84.95 25.91,86.47 R46.1
N$107
  Top 0.254: D20.A 7.24,73.31 R47.1
RELAY
  Top 0.254: R1.1 58.13,8.04 58.87,8.79 58.87,17 57.84,18.03 46.03,18.03 42.65,14.65 40.89,14.65 40.05,13.81 40.05,10.8 39.46,10.21 32.38,10.21 30.35,12.24 14.19,12.24 8.72,17.71 8.72,39.7 1.82,46.61 1.82,52.34 3.99,54.51 21.72,54.51 22.67,55.46 U3.14
RST_LORA
  Top 0.254: LORA-NICERF-V1.NRST 13.46,55.38 19.68,61.61 22.62,61.61 U3.11
RTS  (via drill 0.35)
  Top 0.254: U19.14 53.6,90.8 56.15,88.25 | 56.15,88.25 56.18,88.22 | 56.15,88.25 56.15,63.55 v54.91,62.31
  Bottom 0.254: R42.1 51.28,60.9 52.7,62.31 v54.91,62.31 56,62.31 56.48,61.83 Q16.2
RX  (via drill 0.35)
  Top 0.254: D19.C 24.39,81.78 24.95,81.23 28.93,81.23 31.43,83.73 v31.43,90.06 32.22,90.84 33.59,90.84 U19.3 | v42.19,71.13 41.51,70.45 U3.35
  Bottom 0.254: v31.43,90.06 32.53,91.16 48.87,91.16 50.41,89.62 50.41,75.88 45.08,70.56 42.56,70.56 42.09,71.03 v42.19,71.13
RX_PZEM
  Top 0.254: PZEM004T1.RX 57.42,62.3 56.32,61.2 41.62,61.2 41.27,61.56 U3.28
RX_SIM  (via drill 0.35)
  Top 0.254: v25.08,59.01 U3.13
  Bottom 0.254: SIM800L1.RXD 57.78,80.14 42.37,64.73 42.37,61.04 40.35,59.01 v25.08,59.01
SCK_VSPI  (via drill 0.35)
  Top 0.254: LORA-NICERF-V1.SCK 10.92,65.55 v11.94,66.57 | U3.30 39.46,63.89 v36.81,63.89
  Bottom 0.254: v11.94,66.57 12.68,66.57 16.09,63.16 32.74,63.16 34.15,64.56 34.15,71.63 32.99,72.79 32.99,73.97 34.15,75.14 35.67,75.14 37.06,73.75 37.06,65.98 37.62,65.41 37.62,64.55 37.13,64.06 36.98,64.06 v36.81,63.89
SS_LORA  (via drill 0.3, 0.35)
  Top 0.254: LORA-NICERF-V1.NSS 12.04,61.73 v12.12,61.65 | v36.97,62.19 36.97,62.24 37.56,62.83 U3.29
  Bottom 0.254: v36.97,62.19 36.08,61.3 12.48,61.3 v12.12,61.65
TX  (via drill 0.35)
  Top 0.254: D18.C 29.18,82.92 30.17,83.92 30.17,90.93 v31.31,92.07 U19.2 | v41.94,69.21 39.7,69.21 U3.34
  Bottom 0.254: v31.31,92.07 49.19,92.07 51.35,89.92 51.35,75.31 45.21,69.16 41.98,69.16 v41.94,69.21 | v41.94,69.21
TX_PZEM
  Top 0.254: PZEM004T1.TX 54.88,96.08 55.71,96.91 61.47,96.91 62.41,95.97 62.41,93.25 58.14,88.98 58.14,61.55 56.87,60.29 U3.27
TX_SIM  (via drill 0.35)
  Top 0.254: v35.63,54.53 35.63,56.73 U3.23
  Bottom 0.254: SIM800L1.TXD 56.99,77.6 43.44,64.05 43.44,57.48 40.36,54.4 35.75,54.4 v35.62,54.53 v35.63,54.53
USB_N
  Top 0.203: J2.2 36.81,88.64 35.16,86.99 U19.6
USB_P
  Top 0.203: J2.3 36.16,88.72 35.71,88.26 U19.5
VCC  (via drill 0.35)
  Top 0.254: D3.C 37.91,16.37 38,16.46 | 38,16.46 R2.2 | R2.2 38.05,18.51 | MINI1.IN+ 62.83,20.96 61.24,19.37 38.64,19.37 38,18.72 38,16.46 | U1.3 | U1.3 8.36,84.35 8.36,77.01 9.14,76.22 R47.2 | v8.85,86.72 8.85,85.04 U1.3 | v59.96,88.18 59.96,66.18 59.98,66.16 59.98,66.17 v59.96,66.19 | R2.2 v25.9,16.51 24.73,17.67 24.73,24.47 26.2,25.94 28.19,25.94 v28.23,25.91
  Bottom 0.254: 63.6,51.48 D1.C 63.6,47.06 62.89,46.35 61.5,46.35 60.9,45.75 D2.C 60.9,44.76 56.44,40.3 42.09,40.3 41.08,41.3 41.08,46.37 40.19,47.26 29.39,47.26 28.09,45.95 28.09,25.91 v28.23,25.91 | 63.6,51.48 63.6,52.06 62.86,52.8 C11.2 | v8.85,86.72 8.78,86.72 20.47,98.4 58.87,98.4 59.96,97.32 PZEM004T1.5V 59.96,88.21 59.97,88.19 v59.96,88.18 | v59.96,66.19 63.61,62.54 63.61,51.48 63.6,51.48 | K1.5 25.96,11.19 25.96,16.55 25.94,16.55 v25.9,16.51
VCC_USB  (via drill 0.35)
  Top 0.203: J2.1 37.46,95.31 37.46,93.93 38.05,93.34 U19.16
  Top 0.254: C8.+ 28.51,94.42 v29.14,95.06 | v38.17,95.07 37.7,95.07 37.46,95.31 | v62.05,85.12 62.05,66.15 59.07,63.17 59.07,51.32 v60.12,50.27
  Bottom 0.254: D2.A 60.9,49.49 v60.12,50.27 59.45,50.95 59.45,52.78 C7.2 | v29.14,95.06 38.16,95.06 v38.17,95.07 48.47,95.07 57.26,86.28 60.89,86.28 v62.05,85.12

### Text on the board
tNames: AMPERE | VOLT | RELAY